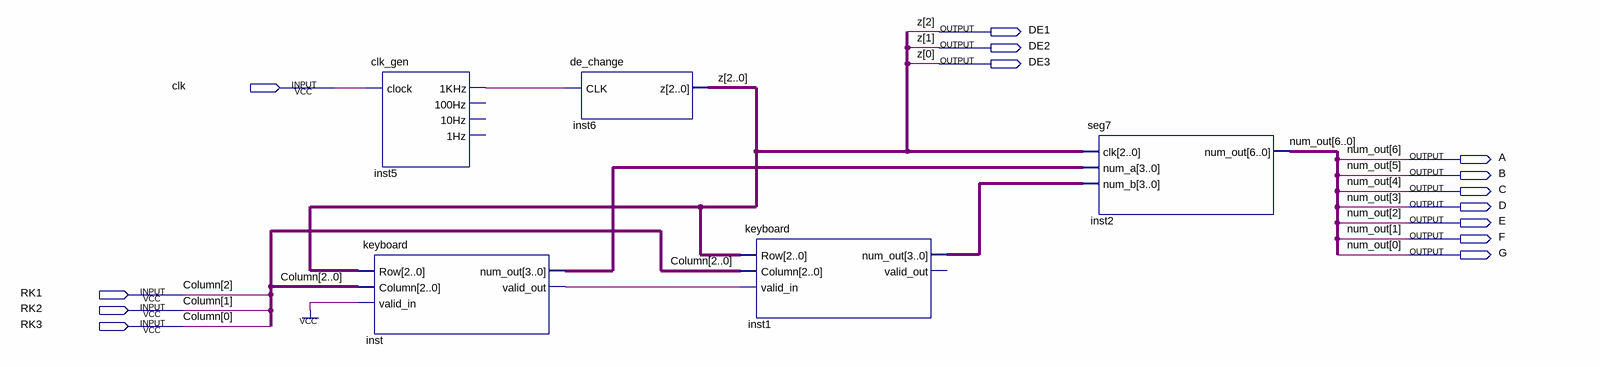
[diagram p0: schematic sheet]
// Quartus schematic key_input.bdf as structural Verilog: 5 symbols, 14 pins
module key_input (
  input  clk,
  input  RK1,
  input  RK2,
  input  RK3,
  output DE1,
  output DE2,
  output DE3,
  output A,
  output B,
  output C,
  output D,
  output E,
  output F,
  output G
);

  wire inst5_1khz, inst_valid_out;
  wire [3:0] inst1_num_out, inst_num_out;

  clk_gen inst5 (.clock(clk), .\1KHz (inst5_1khz));  // open: 100Hz, 10Hz, 1Hz
  keyboard inst (
    .Row({DE1, DE2, DE3}), .Column({RK1, RK2, RK3}), .valid_in(1'b1), .num_out(inst_num_out),
    .valid_out(inst_valid_out));
  de_change inst6 (.CLK(inst5_1khz), .z({DE1, DE2, DE3}));
  keyboard inst1 (
    .Row({DE1, DE2, DE3}), .Column({RK1, RK2, RK3}), .valid_in(inst_valid_out), .num_out(inst1_num_out));  // open: valid_out
  seg7 inst2 (.clk({DE1, DE2, DE3}), .num_a(inst_num_out), .num_b(inst1_num_out), .num_out({A, B, C, D, E, F, G}));

  // Other names for the same wires on the sheet: Column[2:0] = {RK1, RK2, RK3}; num_out[6:0] = {A, B, C, D, E, F, G};
  //   z[2:0] = {DE1, DE2, DE3}
endmodule
